# EAGLE design Ctrl_AVR_Reg_Rev30 (EAGLE 5.03)
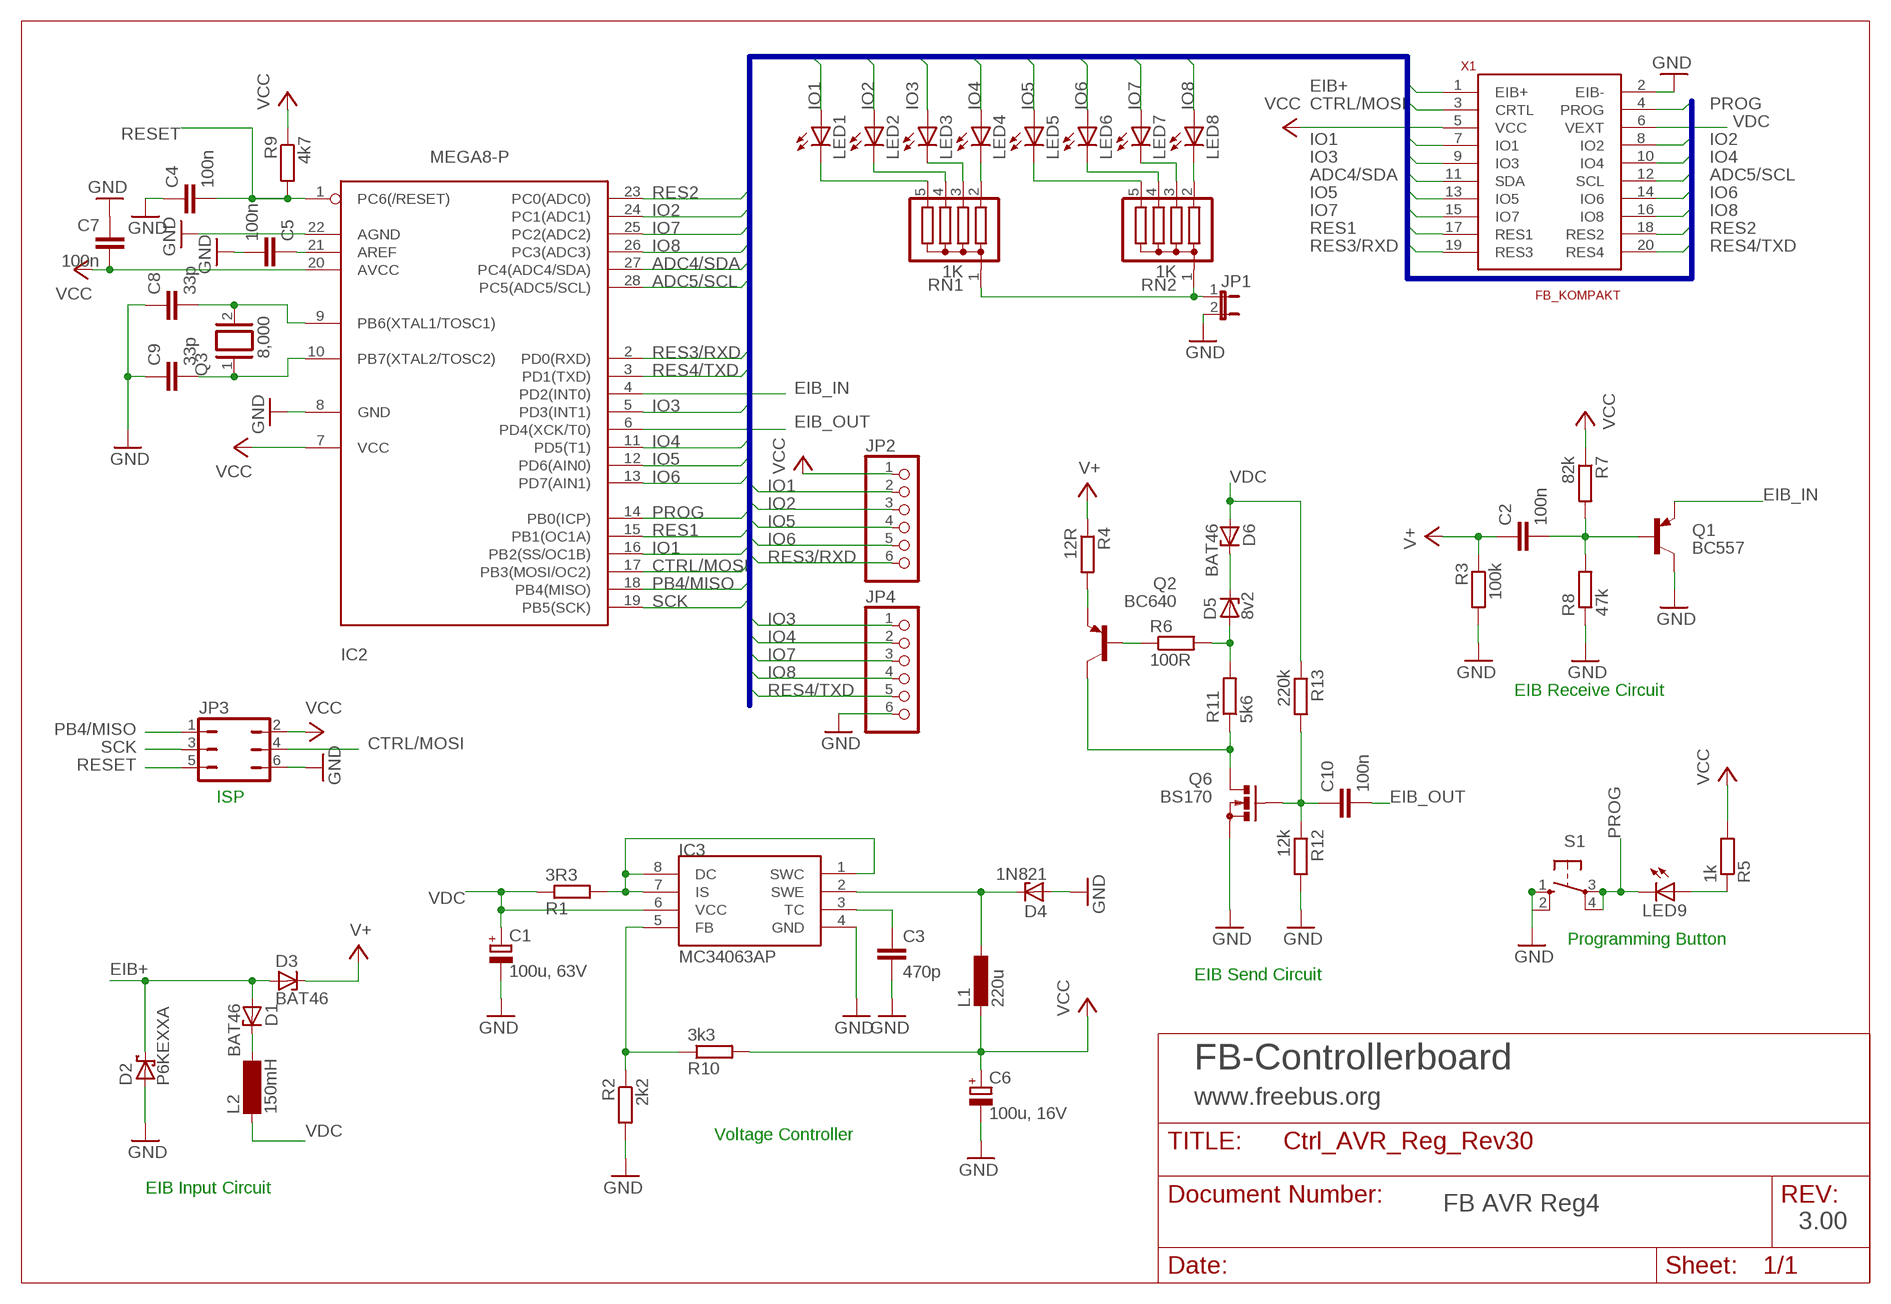
[diagram p0: schematic, sheet 1]

## Parts
C1  100u, 63V  CPOL-EUE5-10.5  [E5-10,5]
C2  100n  C-EU050-025X075  [C050-025X075]
C3  470p  C-EU025-024X044  [C025-024X044]
C4  100n  C-EU050-024X044  [C050-024X044]
C5  100n  C-EU050-025X075  [C050-025X075]
C6  100u, 16V  CPOL-EUE2.5-7  [E2,5-7]
C7  100n  C-EU050-025X075  [C050-025X075]
C8  33p  C-EU025-025X050  [C025-025X050]
C9  33p  C-EU025-025X050  [C025-025X050]
C10  100n  C-EU050-025X075  [C050-025X075]
D1  BAT46  1N821  [DO35Z10]
D2  P6KEXXA  [C1702-15]
D3  BAT46  1N821  [DO35Z10]
D4  1N821  [DO35Z10]
D5  8v2  BZX90  [DO34Z7]
D6  BAT46  1N821  [DO35Z10]
IC2  MEGA8-P  [DIL28-3]
IC3  MC34063AP  [DIL08]
JP1  JP1E  [JP1]
JP2  PINHD-1X6  [1X06]
JP3  JP3Q  [JP3Q]
JP4  PINHD-1X6  [1X06]
L1  220u  L-EU0207/12  [0207/12]
L2  150mH  SD12-1000  [SD12_1000]
LED1  LED3MM  [LED3MM]
LED2  LED3MM  [LED3MM]
LED3  LED3MM  [LED3MM]
LED4  LED3MM  [LED3MM]
LED5  LED3MM  [LED3MM]
LED6  LED3MM  [LED3MM]
LED7  LED3MM  [LED3MM]
LED8  LED3MM  [LED3MM]
LED9  LED3MM  [LED3MM]
Q1  BC557  [TO92]
Q2  BC640  [TO92-BCE]
Q3  8,000  XTAL/S  [QS]
Q6  BS170  [SOT54E]
R1  3R3  R-EU_0207/10  [0207/10]
R2  2k2  R-EU_0207/10  [0207/10]
R3  100k  R-EU_0207/10  [0207/10]
R4  12R  R-EU_0207/10  [0207/10]
R5  1k  R-EU_0207/10  [0207/10]
R6  100R  R-EU_0207/10  [0207/10]
R7  82k  R-EU_0207/10  [0207/10]
R8  47k  R-EU_0207/10  [0207/10]
R9  4k7  R-EU_0207/10  [0207/10]
R10  3k3  R-EU_0207/10  [0207/10]
R11  5k6  R-EU_0207/10  [0207/10]
R12  12k  R-EU_0207/10  [0207/10]
R13  220k  R-EU_0207/10  [0207/10]
RN1  1K  G04R  [SIL5]
RN2  1K  G04R  [SIL5]
S1  10-XX  [B3F-10XX]
X1  FB_KOMPAKT  [ML20]

## Nets
ADC4/SDA: IC2.27(PC4(ADC4/SDA)) X1.11(SDA)
ADC5/SCL: IC2.28(PC5(ADC5/SCL)) X1.12(SCL)
CTRL/MOSI: IC2.17(PB3(MOSI/OC2)) JP3.4 X1.3(CRTL)
EIB+: D1.A D2.C D3.A X1.1(EIB+)
EIB_IN: IC2.4(PD2(INT0)) Q1.1(E)
EIB_OUT: C10.2 IC2.6(PD4(XCK/T0))
GND: C1.- C3.2 C4.1 C5.2 C6.- C7.1 C8.1 C9.1 D2.A D4.A IC2.8(GND) IC2.22(AGND) IC3.4(GND) JP1.2 JP3.6 JP4.6 Q1.3(C) Q6.S R2.2 R3.2 R8.1 R12.2 S1.1(S) S1.2(S1) X1.2(EIB-)
IO1: IC2.16(PB2(SS/OC1B)) JP2.2 LED1.A X1.7(IO1)
IO2: IC2.24(PC1(ADC1)) JP2.3 LED2.A X1.8(IO2)
IO3: IC2.5(PD3(INT1)) JP4.1 LED3.A X1.9(IO3)
IO4: IC2.11(PD5(T1)) JP4.2 LED4.A X1.10(IO4)
IO5: IC2.12(PD6(AIN0)) JP2.4 LED5.A X1.13(IO5)
IO6: IC2.13(PD7(AIN1)) JP2.5 LED6.A X1.14(IO6)
IO7: IC2.25(PC2(ADC2)) JP4.3 LED7.A X1.15(IO7)
IO8: IC2.26(PC3(ADC3)) JP4.4 LED8.A X1.16(IO8)
N$1: Q2.E R4.2
N$2: D5.C D6.C
N$3: C10.1 Q6.G R12.1 R13.2
N$4: Q2.B R6.1
N$5: Q2.C Q6.D R11.1
N$6: D1.C L2.2
N$7 [supply]: C2.2 Q1.2(B) R7.2 R8.2
N$8: C8.2 IC2.9(PB6(XTAL1/TOSC1)) Q3.2
N$9: C9.2 IC2.10(PB7(XTAL2/TOSC2)) Q3.1
N$10: D5.A R6.2 R11.2
N$11: LED4.K(C) RN1.2
N$12: IC3.1(SWC) IC3.7(IS) IC3.8(DC) R1.2
N$13: LED3.K(C) RN1.3
N$14: LED2.K(C) RN1.4
N$15: LED1.K(C) RN1.5
N$16: LED8.K(C) RN2.2
N$17: LED7.K(C) RN2.3
N$18: LED6.K(C) RN2.4
N$19: LED9.A R5.1
N$20: D4.C IC3.2(SWE) L1.1
N$21: C3.1 IC3.3(TC)
N$22: IC3.5(FB) R2.1 R10.1
N$23: LED5.K(C) RN2.5
N$24: C5.1 IC2.21(AREF)
N$25: JP1.1 RN1.1 RN2.1
PB4/MISO: IC2.18(PB4(MISO)) JP3.1
PROG: IC2.14(PB0(ICP)) LED9.K(C) S1.3(P) S1.4(P1) X1.4(PROG)
RES1: IC2.15(PB1(OC1A)) X1.17(RES1)
RES2: IC2.23(PC0(ADC0)) X1.18(RES2)
RES3/RXD: IC2.2(PD0(RXD)) JP2.6 X1.19(RES3)
RES4/TXD: IC2.3(PD1(TXD)) JP4.5 X1.20(RES4)
RESET: C4.2 IC2.1(PC6(/RESET)) JP3.5 R9.2
SCK: IC2.19(PB5(SCK)) JP3.3
V+: C2.1 D3.C R3.1 R4.1
VCC: C6.+ C7.2 IC2.7(VCC) IC2.20(AVCC) JP2.1 JP3.2 L1.2 R5.2 R7.1 R9.1 R10.2 X1.5(VCC)
VDC [supply]: C1.+ D6.A IC3.6(VCC) L2.1 R1.1 R13.1 X1.6(VEXT)

## Buses
IO1,IO2,IO3,IO4,IO5,IO6,IO7,IO8,ADC4/SDA,ADC5/SCL,RES1,RES2,RES3/RXD,RES4/TXD,CTRL/MOSI,PROG,PB4/MISO,EIB+,SCK

## Notes on the sheet
- EIB Receive Circuit
- ISP
- Programming Button
- EIB Send Circuit
- FB-Controllerboard
- www.freebus.org
- Voltage Controller
- EIB Input Circuit
- FB AVR Reg4
- 3.00

## Library data of the parts
C1 C6 = rcl:CPOL-EU: POLARIZED CAPACITOR, European symbol
C2-C5 C7-C10 = rcl:C-EU: CAPACITOR, European symbol
D1 D3 D4 D6 = diode:1N821: Reference DIODE temperature compensated, 6,2 V
D2 = diode:P6KEXXA: DIODE transient-voltage suppressor
D5 = diode:BZX90: Z DIODE
IC2 = atmel:MEGA8-P: MICROCONTROLLER 8 Kbytes FLASH, 1 kbytes SRAM, 512 bytes EEPROM, USART, 4-channel 10 bit ADC, 2-channel 8 bit ADC Pin compatible with Atmega48, ATMega88, ATMega168 Source: avr.lbr
IC3 = mc34063:MC34063
JP1 = jumper:JP1E: JUMPER
JP2 JP4 = pinhead:PINHD-1X6: PIN HEADER
JP3 = jumper:JP3Q: JUMPER
L1 = rcl:L-EU: INDUCTOR, European symbol
L2 = inductor-neosid:SD12: INDUCTOR nominal inductance
LED1-LED9 = led:LED: LED OSRAM: - CHIPLED LG R971, LG N971, LY N971, LG Q971, LY Q971, LO R971, LY R971 LH N974, LH R974 LS Q976, LO Q976, LY Q976 LO Q996 - Hyper CHIPLED LW Q18S LB Q993, LB Q99A, LB R99A - SideLED LS A670, LO A670, LY A670, LG A670, LP A670 LB A673, LV A673, LT A673, LW A673 LH A674 LY A675 LS A676, LA A676, LO A676, LY A676, LW A676 LS A679, LY A679, LG A679 - Hyper Micro SIDELED® LS Y876, LA Y876, LO Y876, LY Y876 LT Y87S - SmartLED LW L88C, LW L88S LB L89C, LB L89S, LG L890 LS L89K, LO L89K, LY L89K LS L896, LA L896, LO L896, LY L896 - TOPLED LS T670, LO T670, LY T670, LG T670, LP T670 LSG T670, LSP T670, LSY T670, LOP T670, LYG T670 LG T671, LOG T671, LSG T671 LB T673, LV T673, LT T673, LW T673 LH T674 LS T676, LA T676, LO T676, LY T676, LB T676, LH T676, LSB T676, LW T676 LB T67C, LV T67C, LT T67C, LS T67K, LO T67K, LY T67K, LW E67C LS E67B, LA E67B, LO E67B, LY E67B, LB E67C, LV E67C, LT E67C LW T67C LS T679, LY T679, LG T679 LS T770, LO T770, LY T770, LG T770, LP T770 LB T773, LV T773, LT T773, LW T773 LH T774 LS E675, LA E675, LY E675, LS T675 LS T776, LA T776, LO T776, LY T776, LB T776 LHGB T686 LT T68C, LB T68C - Hyper Mini TOPLED® LB M676 - Mini TOPLED Santana® LG M470 LS M47K, LO M47K, LY M47K Source: http://www.osram.convergy.de - LUMILED® LXK2-PW12-R00, LXK2-PW12-S00, LXK2-PW14-U00, LXK2-PW14-V00 LXK2-PM12-R00, LXK2-PM12-S00, LXK2-PM14-U00 LXK2-PE12-Q00, LXK2-PE12-R00, LXK2-PE12-S00, LXK2-PE14-T00, LXK2-PE14-U00 LXK2-PB12-K00, LXK2-PB12-L00, LXK2-PB12-M00, LXK2-PB14-N00, LXK2-PB14-P00, LXK2-PB14-Q00 LXK2-PR12-L00, LXK2-PR12-M00, LXK2-PR14-Q00, LXK2-PR14-R00 LXK2-PD12-Q00, LXK2-PD12-R00, LXK2-PD12-S00 LXK2-PH12-R00, LXK2-PH12-S00 LXK2-PL12-P00, LXK2-PL12-Q00, LXK2-PL12-R00 Source: www.luxeon.com
Q1 = transistor-pnp:BC557: PNP Transistor
Q2 = transistor-pnp:BC640*: PNP Transistror
Q3 = special:XTAL/S: CRYSTAL
Q6 = transistor-small-signal:BS170: N-CHANNEL MOS FET
R1-R13 = rcl:R-EU_: RESISTOR, European symbol
RN1 RN2 = resistor-sil:G04R: SIL RESISTOR
S1 = switch-omron:10-XX: OMRON SWITCH
X1 = EIB_Freebus:FB_KOMPAKT: Steckverbinder für Controller <--> Anwendung Kompaktversion Vorteile: - Das Symbol im Schaltplan sieht so aus wie auf dem PCB - Vielleicht schneller zu überblicken, was an welchem Pin angeschlossen ist Nachteile: - Viele unnötige Leitungen im Schaltplan notwendig

## Net classes
0 default: width 0.406 mm
1 supply: width 0.406 mm

## Board
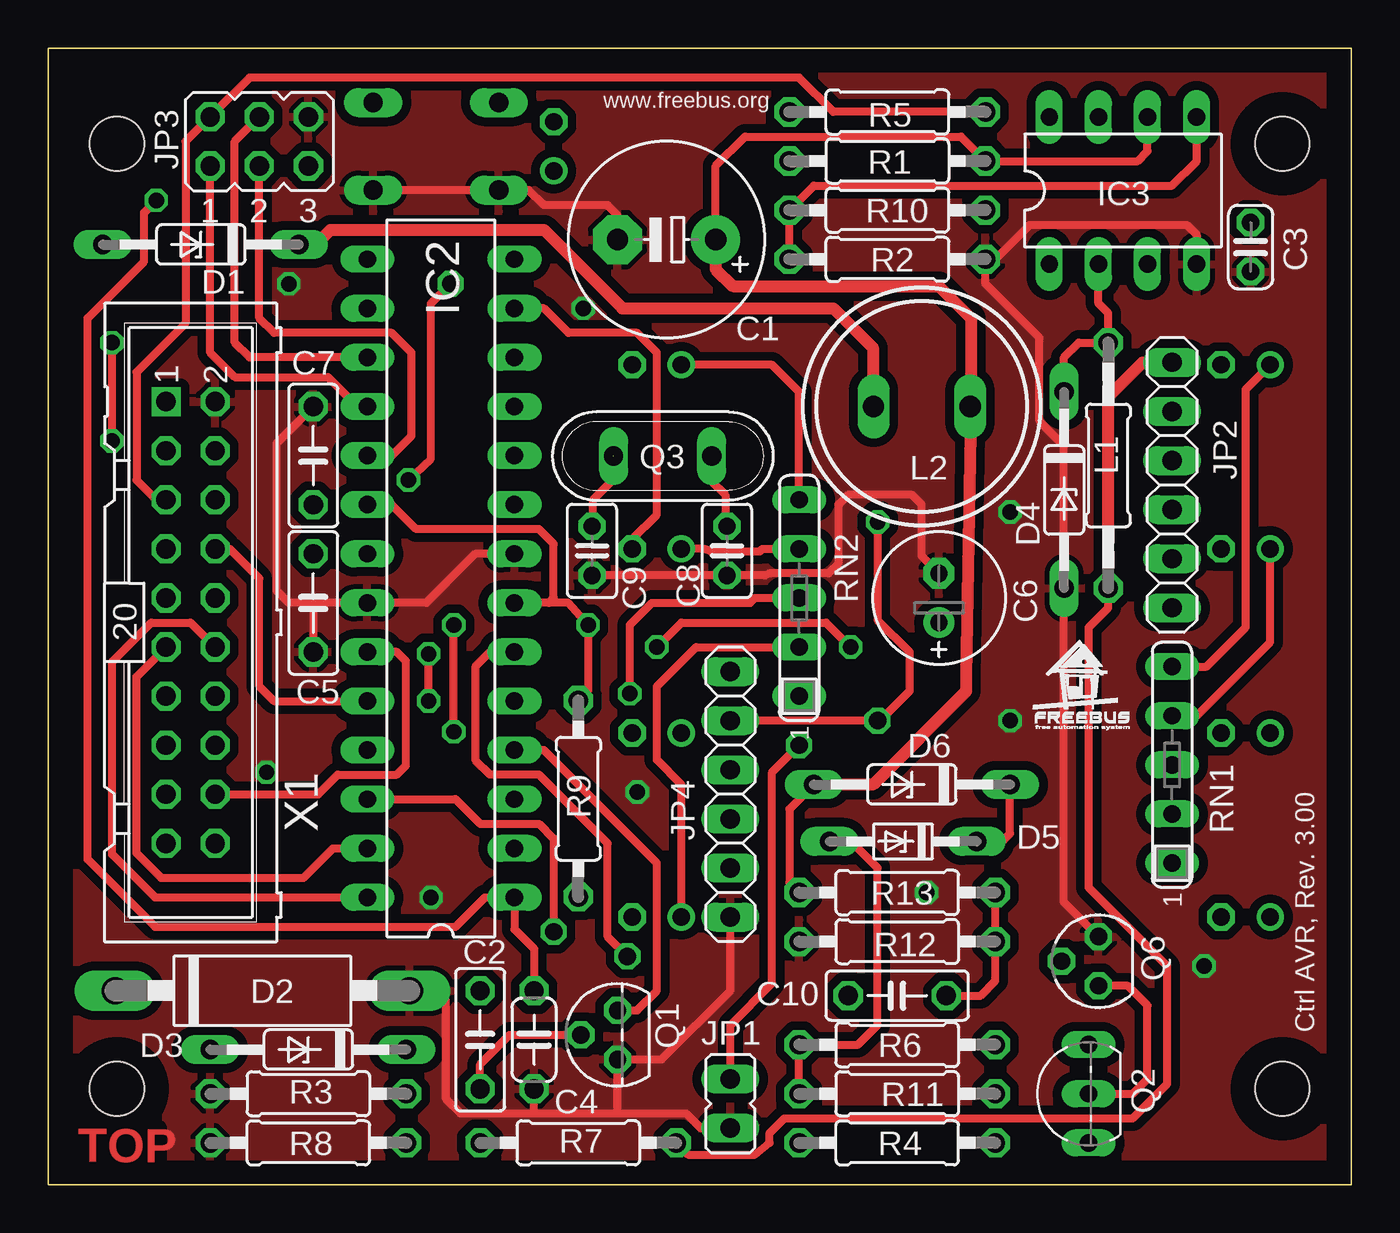
[diagram p1: board, top side]
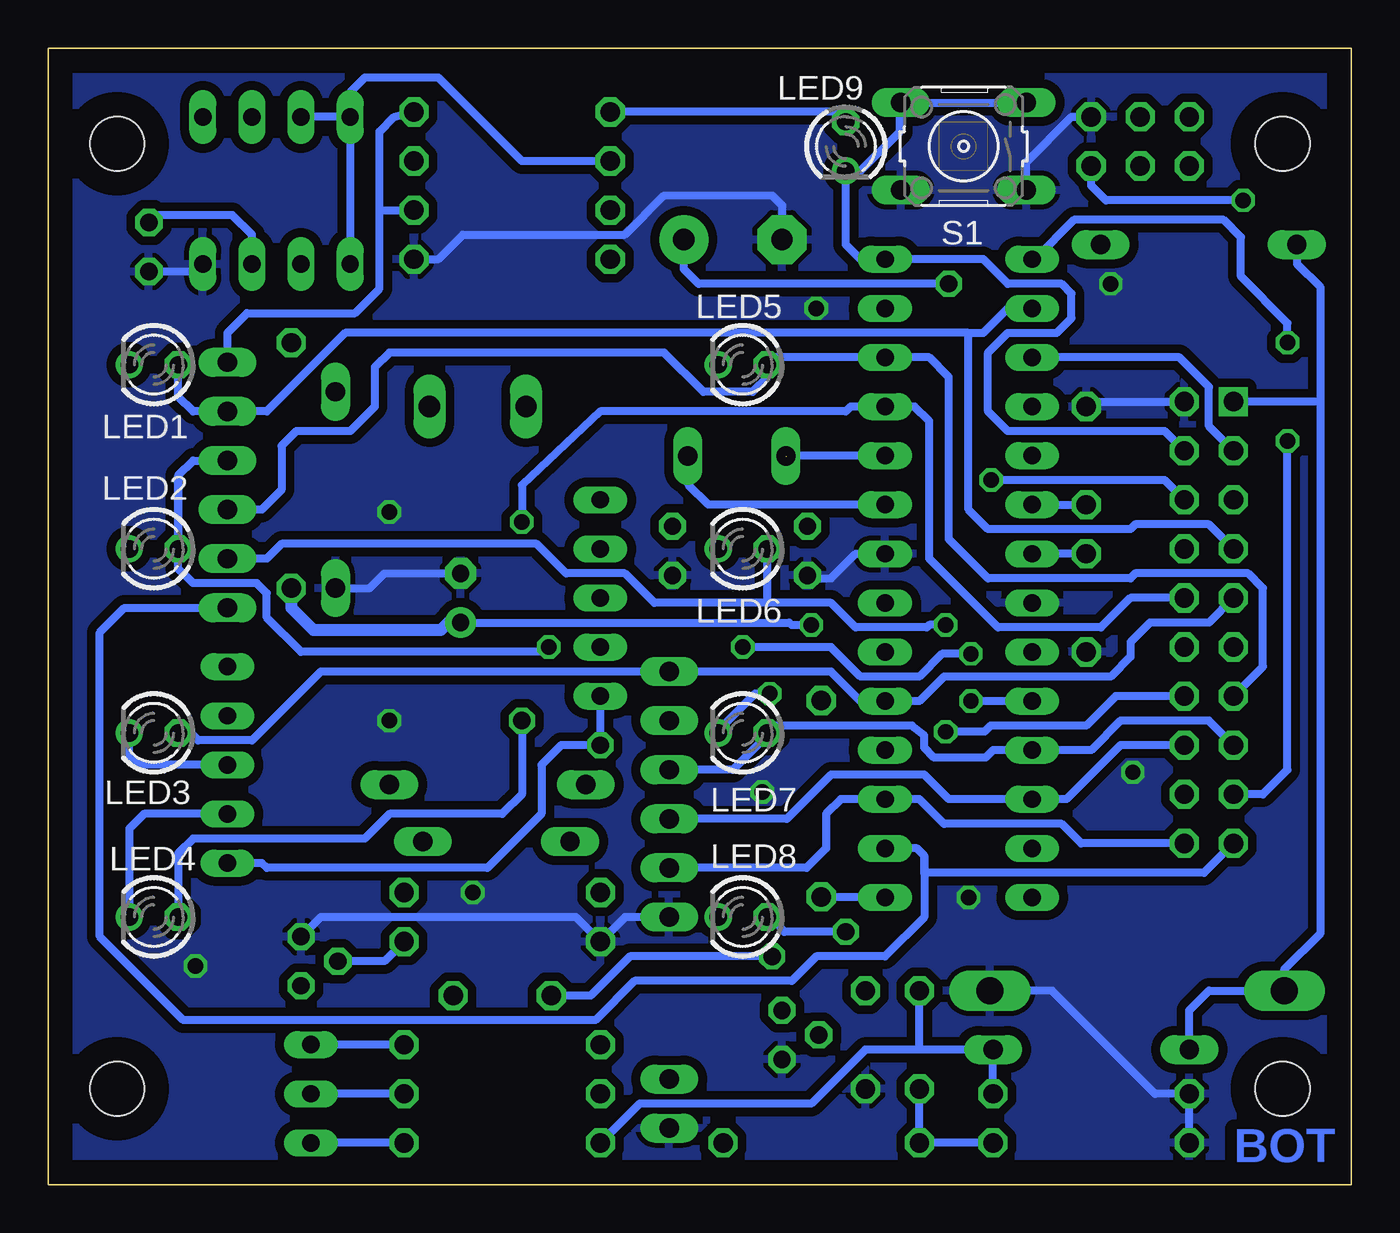
[diagram p2: board, bottom side, seen from below]

Size 67.44 x 58.79 mm. Coordinates in mm from the lower left corner, seen from the top.
Outline: 0,58.79 0,0 67.44,0 67.44,58.79 0,58.79
Copper layers (1*16): Top 0.035mm / dielectric 1.5mm / Bottom 0.035mm
Design rules "idefix-default *": minimum track width 10mil, minimum drill 24mil, track to track 18mil, track to pad 12mil, pad to pad 8mil, via to via 12mil, smd to smd 8mil, copper to edge 50mil, drill to drill 45mil, minimum pad ring 10mil, minimum via ring 8mil, stop-mask expansion 4mil, vias tented up to drill 0mil, thermal gap 10mil
Holes 2.8 mm at 3.55,53.84 63.88,4.95 63.88,53.84 3.55,4.95
Milling: 4 lines

### Footprints (pad centres in the part's own frame; a part is rotated, then mirrored left to right if it is on the bottom)
E5-10,5 = drill 1.1 pad 2.54 round: + -2.54,0 | drill 1.1 pad 2.54 octagon: - 2.54,0
C050-025X075 = drill 1 octagon: 1 -2.54,0; 2 2.54,0
C025-024X044 = drill 0.9 octagon: 1 -1.27,0; 2 1.27,0
C050-024X044 = drill 1 octagon: 1 -2.54,0; 2 2.54,0
E2,5-7 = drill 0.9 pad 1.6 round: + -1.27,0 | drill 0.9 pad 1.6 octagon: - 1.27,0
C025-025X050 = drill 0.9 octagon: 1 -1.27,0; 2 1.27,0
DO35Z10 = drill 1 long: A 5.08,0; C -5.08,0
C1702-15 = drill 1.4 long: A 7.62,0; C -7.62,0
DO34Z7 = drill 1 long: A 3.81,0; C -3.81,0
DIL28-3 = drill 0.9 long: 1 -16.51,-3.81; 2 -13.97,-3.81; 3 -11.43,-3.81; 4 -8.89,-3.81; 5 -6.35,-3.81; 6 -3.81,-3.81; 7 -1.27,-3.81; 8 1.27,-3.81; 9 3.81,-3.81; 10 6.35,-3.81; 11 8.89,-3.81; 12 11.43,-3.81; 13 13.97,-3.81; 14 16.51,-3.81; 15 16.51,3.81; 16 13.97,3.81; 17 11.43,3.81; 18 8.89,3.81; 19 6.35,3.81; 20 3.81,3.81; 21 1.27,3.81; 22 -1.27,3.81; 23 -3.81,3.81; 24 -6.35,3.81; 25 -8.89,3.81; 26 -11.43,3.81; 27 -13.97,3.81; 28 -16.51,3.81
DIL08 = drill 0.9 long: 1 -3.81,-3.81; 2 -1.27,-3.81; 3 1.27,-3.81; 4 3.81,-3.81; 5 3.81,3.81; 6 1.27,3.81; 7 -1.27,3.81; 8 -3.81,3.81
JP1 = drill 1 long: 1 0,-1.27; 2 0,1.27
1X06 = drill 1 long: 1 -6.35,0; 2 -3.81,0; 3 -1.27,0; 4 1.27,0; 5 3.81,0; 6 6.35,0
JP3Q = drill 1 octagon: 1 -2.54,-1.27; 2 -2.54,1.27; 3 0,-1.27; 4 0,1.27; 5 2.54,-1.27; 6 2.54,1.27
0207/12 = drill 1 octagon: 1 -6.35,0; 2 6.35,0
SD12_1000 = drill 1.1 long: 1 -2.5,0; 2 2.5,0
LED3MM = drill 0.9 octagon: A -1.27,0 | drill 0.9 round: K 1.27,0
TO92 = drill 0.9 octagon: 1 1.27,0; 2 0,1.905; 3 -1.27,0
TO92-BCE = drill 0.9 long: B 2.54,0; C 0,0; E -2.54,0
QS = drill 1 long: 1 -2.54,0; 2 2.54,0
SOT54E = drill 0.9 octagon: D -1.27,0; G 0,1.905; S 1.27,0
0207/10 = drill 1 octagon: 1 -5.08,0; 2 5.08,0
SIL5 = drill 0.9 long: 1 -5.08,0; 2 -2.54,0; 3 0,0; 4 2.54,0; 5 5.08,0
B3F-10XX = drill 1 long: 1 -3.251,2.261; 2 3.251,2.261; 3 -3.251,-2.261; 4 3.251,-2.261
ML20 = drill 1 square: 1 -11.43,-1.27 | drill 1 octagon: 2 -11.43,1.27; 3 -8.89,-1.27; 4 -8.89,1.27; 5 -6.35,-1.27; 6 -6.35,1.27; 7 -3.81,-1.27; 8 -3.81,1.27; 9 -1.27,-1.27; 10 -1.27,1.27; 11 1.27,-1.27; 12 1.27,1.27; 13 3.81,-1.27; 14 3.81,1.27; 15 6.35,-1.27; 16 6.35,1.27; 17 8.89,-1.27; 18 8.89,1.27; 19 11.43,-1.27; 20 11.43,1.27

### Placement (x,y rotation side)
C1  32,48.89 180 top
C2  22.35,7.49 270 top
C3  62.23,48.51 270 top
C4  25.14,7.49 90 top
C5  13.71,30.1 270 top
C6  46.1,30.35 90 top
C7  13.71,37.72 270 top
C8  35.13,32.79 90 top
C9  28.14,32.79 90 top
C10  43.94,9.78 180 top
D1  1N821  [DO35Z10]  7.9,48.64 180 top
D2  11.08,10.03 0 top
D3  1N821  [DO35Z10]  13.46,6.98 180 top
D4  52.58,35.94 270 top
D5  BZX90  [DO34Z7]  44.24,17.75 180 top
D6  1N821  [DO35Z10]  44.7,20.7 180 top
IC2  20.32,31.37 90 top
IC3  55.62,51.43 0 top
JP1  35.3,4.19 180 top
JP2  58.16,36.19 270 top
JP3  10.92,53.97 0 top
JP4  35.3,20.19 270 top
L1  54.86,37.21 270 top
L2  45.21,40.26 180 top
LED1  61.97,42.41 180 bottom
LED2  61.97,32.89 180 bottom
LED3  61.97,23.37 180 bottom
LED4  61.97,13.84 180 bottom
LED5  31.49,42.41 180 bottom
LED6  31.49,32.89 180 bottom
LED7  31.49,23.37 180 bottom
LED8  31.49,13.84 180 bottom
LED9  26.16,53.72 270 bottom
Q1  29.46,7.74 90 top
Q2  53.85,4.7 90 top
Q3  31.8,37.69 0 top
Q6  54.35,11.55 90 top
R1  43.43,52.96 180 top
R2  43.43,47.88 0 top
R3  13.46,4.7 180 top
R4  43.94,2.16 0 top
R5  43.43,55.5 0 top
R6  43.94,7.24 180 top
R7  27.43,2.16 180 top
R8  13.46,2.16 0 top
R9  27.43,19.96 270 top
R10  43.43,50.42 0 top
R11  43.94,4.7 180 top
R12  43.94,12.57 180 top
R13  43.94,15.11 0 top
RN1  58.16,21.71 90 top
RN2  38.86,30.35 90 top
S1  20.06,53.72 180 bottom
X1  7.36,29.08 270 top

### Tracks (layer width: path | path; a pad name or v marks a point on that pad's centre or on a via)
ADC4/SDA
  Top 0.406: X1.11 4.57,26.29 4.57,17.14 5.84,15.87 13.21,15.87 14.73,17.4 IC2.27
ADC5/SCL
  Top 0.406: IC2.28 5.52,14.86 3.3,17.08 3.3,27.05 5.33,29.08 7.36,29.08 X1.12
CTRL/MOSI
  Top 0.406: JP3.4 9.65,53.97 9.65,43.56 10.41,42.8 IC2.17
  Bottom 0.406: X1.3 7.36,39.24 7.36,41.27 8.89,42.8 IC2.17
EIB+
  Bottom 0.406: 1.59,40.51 1.59,46.41 2.79,47.62 2.79,48.64 D1.A | 1.59,40.51 X1.1 | 1.59,40.51 1.59,13.01 3.46,11.14 D2.C 7.36,10.03 8.38,9.01 8.38,7.24 8.63,6.98 D3.A
EIB_IN
  Top 0.406: Q1.1 30.48,9.01 31.49,10.03 31.49,16.63 25.65,22.48 IC2.4
EIB_OUT  (via drill 0.9)
  Top 0.406: IC2.6 22.86,27.56 22.13,26.83 22.13,21.94 22.86,21.21 25.4,21.21 28.95,17.65 28.95,12.82 v29.97,11.81
  Bottom 0.406: v29.97,11.81 37.34,11.81 39.37,9.78 C10.2
GND  (via drill 0.8)
  Top 0.406: 13.71,30.1 C5.2 | 13.71,30.1 IC2.22 19.56,30.1 22.1,32.64 IC2.8 | C7.1 11.81,38.35 11.81,30.73 12.44,30.1 13.71,30.1 | JP1.2 33.78,2.92 33.02,3.68 29.46,3.68 | 25.14,3.68 21.33,3.68 20.57,4.44 20.57,9.52 20.06,10.03 D2.A | 25.14,3.68 29.46,3.68 | 29.46,3.68 Q1.3 31.75,6.47 35.3,10.03 JP4.6 | 25.14,3.68 C4.1 | S1.1 16.99,51.46 17.02,51.43 17.04,51.46 S1.2 24.87,51.46 25.65,50.67 28.95,50.67 29.46,50.16 C1.- | IC3.4 59.18,47.62 59.43,47.88 59.43,49.15 58.93,49.65 50.8,49.65 49.02,47.88 R2.2 48.51,46.61 51.31,43.81 51.31,39.49 52.58,38.22 D4.A 52.58,14.6 Q6.S | C6.- 45.21,32.51 45.21,35.18 44.7,35.68 41.4,35.68 40.89,35.18 40.89,32.13 40.38,31.62 37.34,31.62 37.11,31.52 C8.1 C9.1
  Bottom 0.406: R2.2 47.24,47.88 45.97,49.15 37.59,49.15 35.56,51.18 29.97,51.18 29.46,50.67 C1.- | IC2.8 25.65,32.64 26.92,31.37 27.68,31.37 27.71,31.39 C9.1 | C7.1 13.46,40.51 X1.2 | R8.1 R3.2 10.16,4.7 15.49,10.03 D2.A | JP4.6 37.59,13.84 R12.2 40.13,13.84 53.34,13.84 Q6.S | S1.1 16.81,52.9 14.48,55.24 JP3.6 | C6.- 50.04,31.62 50.8,30.86 D4.A | IC3.4 59.82,47.24 C3.2
  other vias: 27.68,45.34 11.3,21.33 59.82,11.3 45.46,15.11 30.48,20.32 49.78,24 49.78,34.79 12.44,46.61 19.81,14.86
  pour Top: 0.25,58.29 0.25,0.12 57.49,0.09 57.42,0.13 67.18,0.06 67.31,24.38 67.31,58.29
  pour Bottom: 0.3,58.29 67.21,58.29 67.21,0.43 16.95,0.23 9.81,0.17 0.3,0.17
IO1
  Bottom 0.406: IC2.16 17.78,45.34 19.05,44.07 19.81,44.07 | 19.81,44.07 52.07,44.07 56.13,40 JP2.2 59.94,40 60.7,40.76 LED1.A | X1.7 7.36,34.16 11.17,34.16 11.43,33.91 18.79,33.91 19.81,34.92 19.81,44.07
IO2  (via drill 0.8)
  Top 0.406: IC2.24 11.68,25.02 10.92,25.78 10.92,31.37 9.4,32.89 X1.8 | v19.68,25.02 v19.68,27.46 | v31.49,27.81 32.76,29.08 40.26,29.08 v41.53,27.81
  Bottom 0.406: LED2.A 60.45,32.89 60.7,33.14 60.7,36.7 | JP2.3 59.94,37.46 60.7,36.7 | 60.7,36.7 60.7,31.87 59.94,31.11 56.64,31.11 56.13,30.6 56.13,29.33 54.35,27.56 41.78,27.56 v41.53,27.81 | IC2.24 v19.68,25.02 | v19.68,27.46 21.18,27.46 22.35,26.29 25.4,26.29 26.92,27.81 v31.49,27.81
IO3
  Bottom 0.406: X1.9 7.36,29.08 10.41,29.08 11.43,28.06 11.43,27.3 12.44,26.29 21.08,26.29 22.35,25.02 IC2.5 25.4,25.02 26.92,26.54 JP4.1 53.34,26.54 56.89,22.98 59.69,22.98 60.07,23.37 LED3.A
IO4  (via drill 0.8, 0.9)
  Top 0.406: JP4.2 v42.92,24 43.05,24 44.58,25.52 44.58,27.56 42.92,29.21 v42.92,34.29
  Bottom 0.406: v42.92,34.29 42.92,36.19 38.86,40 26.16,40 25.91,40.26 IC2.11 22.6,40.26 21.84,39.49 21.84,32.38 18.29,28.83 12.95,28.83 11.43,30.35 X1.10 | LED4.A 60.7,17.14 59.94,17.9 51.05,17.9 49.78,19.17 43.94,19.17 42.92,20.19 v42.92,24
IO5
  Bottom 0.406: JP2.4 56.39,34.92 55.37,35.94 55.37,38.22 54.61,38.99 51.81,38.99 50.54,40.26 50.54,42.29 49.78,43.05 35.56,43.05 33.53,41.02 30.99,41.02 30.22,41.78 LED5.A 30.22,42.54 29.97,42.8 IC2.12 21.84,42.8 20.83,41.78 20.83,33.4 18.79,31.37 11.43,31.37 11.17,31.62 5.33,31.62 4.57,30.86 4.57,26.79 X1.13
IO6  (via drill 0.8)
  Top 0.406: LED6.A 30.22,33.4 31.49,34.67 31.49,43.05 30.48,44.07 26.92,44.07 25.65,45.34 IC2.13 | v20.99,23.43 v20.99,28.95
  Bottom 0.406: 30.22,30.1 36.07,30.1 37.59,31.62 40.64,31.62 42.16,33.14 55.37,33.14 56.13,32.38 JP2.5 | 30.22,30.1 LED6.A | X1.14 12.19,25.27 13.71,23.75 18.67,23.75 18.99,23.43 v20.99,23.43 | 20.95,28.95 v20.99,28.95 21.84,28.95 21.97,28.83 25.65,28.83 26.92,30.1 30.22,30.1
IO7
  Bottom 0.406: X1.15 7.36,24 11.94,24 13.46,22.48 IC2.25 18.54,22.48 18.92,22.1 21.59,22.1 22.1,22.6 22.1,23.24 22.73,23.75 29.72,23.75 30.22,23.24 | 30.22,23.24 LED7.A | 30.22,23.24 32,21.46 JP4.3
IO8  (via drill 0.9)
  Top 0.406: IC2.26 21.08,19.94 22.35,18.67 25.4,18.67 26.16,17.9 v26.16,13.08
  Bottom 0.406: X1.16 11.94,22.73 14.73,19.94 IC2.26 20.83,19.94 22.1,21.21 26.92,21.21 29.21,18.92 JP4.4 | LED8.A 29.97,13.84 29.34,13.08 v26.16,13.08
N$1
  Bottom 0.406: R4.2 Q2.E
N$2
  Top 0.406: D5.C 49.38,17.75 49.78,18.16 D6.C
N$3
  Top 0.406: R13.2 R12.1 49.02,10.54 48.26,9.78 C10.1
  Bottom 0.406: R12.1 50.04,11.55 Q6.G
N$4
  Bottom 0.406: R6.1 Q2.B
N$5
  Top 0.406: Q6.D 55.88,10.28 56.89,9.27 56.89,5.46 56.13,4.7 Q2.C
  Bottom 0.406: R11.1 Q2.C 54.1,4.95
N$6
  Top 0.61: D1.C 13.84,48.64 14.6,49.4 25.65,49.4 29.72,45.34 40.64,45.34 42.67,43.3 42.67,40.26 L2.2
N$7
  Top 0.406: C2.2 22.35,6.22 23.87,7.74 Q1.2
  Bottom 0.406: R8.2 R7.2 C2.2
N$8
  Top 0.406: Q3.2 34.34,36.39 35.05,35.68 35.05,33.91 35.08,33.93 C8.2
  Bottom 0.406: IC2.9 33.27,35.18 34.29,36.19 34.29,37.46 34.34,37.51 Q3.2
N$9  (1 unrouted)
  Top 0.406: 29.23,37.69 29.23,36.47 28.19,35.43 28.19,33.91 28.17,33.93 C9.2
  Bottom 0.406: 29.23,37.82 29.21,37.72 28.95,37.72 | IC2.10 28.95,37.72 | 29.23,37.82 29.21,37.69 28.95,37.72 | 29.23,37.82 29.23,37.72 29.26,37.72 Q3.1
N$10
  Top 0.406: R11.2 R6.2 41.91,7.24 42.92,8.25 42.92,16.38 41.55,17.75 D5.A
N$11
  Bottom 0.406: RN1.2 62.48,19.17 63.24,18.41 LED4.K
N$12
  Bottom 0.406: IC3.8 IC3.7 | IC3.8 IC3.1 | R1.2 42.92,52.96 47.24,57.27 51.05,57.27 51.81,56.51 51.81,55.75 52.07,55.5 IC3.8
N$13
  Bottom 0.406: RN1.3 62.74,21.71 63.24,22.22 LED3.K
N$14
  Top 0.406: LED2.K 63.24,28.06 59.43,24.25 RN1.4
N$15
  Top 0.406: LED1.K 61.97,41.14 61.97,28.83 59.94,26.79 RN1.5
N$16
  Top 0.406: LED8.K 32.76,20.7 31.49,21.97 31.49,25.78 33.53,27.81 RN2.2
N$17  (via drill 0.8)
  Top 0.406: RN2.3 36.57,30.35 36.32,30.1 31.24,30.1 30.1,28.95 v30.1,25.4
  Bottom 0.406: LED7.K 32.76,23.49 30.86,25.4 v30.1,25.4
N$18
  Top 0.406: RN2.4 36.96,32.89 36.83,32.76 34.29,32.76 33.91,32.89 LED6.K
N$19
  Bottom 0.406: R5.1 26.67,55.5 LED9.A
N$20
  Top 0.406: D4.C 52.58,42.8 53.34,43.56 L1.1 54.86,45.08 54.35,45.59 IC3.2
N$21
  Bottom 0.406: IC3.3 56.89,49.15 57.91,50.16 61.85,50.16 C3.1
N$22
  Top 0.406: R2.1 R10.1 39.62,51.69 58.16,51.69 59.43,52.96 IC3.5
N$23
  Top 0.406: LED5.K 37.46,42.41 38.86,41.02 RN2.5
N$24
  Bottom 0.406: 13.46,32.64 C5.1 IC2.21
N$25  (via drill 0.9)
  Top 0.406: JP1.1 35.3,8.25 37.46,10.41 37.46,21.33 v38.86,22.73
  Bottom 0.406: v38.86,22.73 RN2.1 | v38.86,22.73 38.61,22.73 | v38.86,22.73 40.89,22.73 41.91,21.71 41.91,19.17 44.7,16.38 56.13,16.38 56.39,16.63 RN1.1
PB4/MISO
  Top 0.406: IC2.18 16,40.26 14.48,41.78 9.65,41.78 8.38,43.05 JP3.1
PROG
  Bottom 0.406: S1.4 S1.3 | S1.4 23.34,55.98 23.37,56 | S1.4 23.32,55.8 23.37,55.75 23.37,54.48 25.4,52.45 LED9.K 26.16,48.64 25.4,47.88 IC2.14 19.05,47.88 17.78,46.61 14.98,46.61 14.48,46.1 14.48,44.83 15.24,44.07 17.78,44.07 18.79,43.05 18.79,40 17.78,38.99 9.65,38.99 X1.4
RES1  (via drill 0.8)
  Top 0.406: v3.3,38.48 v3.3,43.56
  Bottom 0.406: IC2.15 16.38,47.88 14.35,49.91 6.6,49.91 5.71,49.02 5.71,46.99 3.3,44.57 v3.3,43.56 | X1.17 4.57,20.19 3.3,21.46 v3.3,38.48
RES2
  Top 0.406: X1.18 13.97,20.19 14.98,21.21 18.03,21.21 18.51,21.68 18.51,27.08 18.03,27.56 IC2.23
RES3/RXD
  Bottom 0.406: X1.19 7.62,16.13 22.1,16.13 22.1,17.02 | 22.1,17.02 22.48,17.4 IC2.2 | 22.1,17.02 22.1,13.84 24.13,11.81 27.68,11.81 28.95,10.54 37.08,10.54 39.11,8.51 60.45,8.51 64.77,12.82 64.77,28.57 63.5,29.84 JP2.6
RES4/TXD
  Bottom 0.406: X1.20 13.97,17.65 14.98,18.67 21.08,18.67 22.35,19.94 IC2.3 26.41,19.94 27.18,19.17 27.18,17.4 28.19,16.38 JP4.5
RESET  (via drill 0.8)
  Top 0.406: C4.2 25.14,12.19 24.13,13.21 IC2.1 22.6,14.86 21.08,13.33 5.52,13.33 2.03,16.82 2.03,44.83 4.95,47.75 4.95,50.29 v5.59,50.92
  Bottom 0.406: R9.2 27.43,14.86 IC2.1 | v5.59,50.92 12.7,50.92 13.46,51.69 JP3.5
SCK
  Top 0.406: JP3.3 10.92,44.83 11.68,44.07 17.78,44.07 18.79,43.05 18.79,38.73 17.78,37.72 IC2.19
V+
  Bottom 0.406: R3.1 D3.C 22.35,6.98 | R4.1 36.83,4.19 27.94,4.19 25.14,6.98 22.35,6.98 | 22.35,6.98 C2.1
VCC  (via drill 0.8)
  Top 0.406: 25.91,30.1 IC2.7 | 27.43,25.02 R9.1 27.94,25.55 v27.94,28.95 26.92,30.1 25.91,30.1 | IC2.20 17.78,35.18 19.05,33.91 25.4,33.91 26.16,33.14 26.16,30.35 25.91,30.1 | R7.1 33.11,1.55 36.57,1.55 37.34,2.16 37.34,2.66 38.1,3.43 56.13,3.43 57.91,5.2 57.91,11.3 53.85,15.36 53.85,28.83 54.86,29.84 L1.2 | X1.5 5.59,35.43 4.57,36.45 4.57,42.03 7.11,44.57 7.11,53.97 JP3.2 10.41,57.27 38.86,57.27 40.64,55.5 R5.2 48.77,55.5
  Top 0.61: JP2.1 56.64,42.54 54.86,40.76 L1.2
  Bottom 0.406: JP2.1 58.16,44.07 57.15,45.08 51.56,45.08 50.29,46.35 50.29,50.42 | R10.2 48.51,50.67 48.77,50.42 50.29,50.42 | IC2.20 C7.2 | 50.29,50.42 50.29,54.48 49.53,55.24 R5.2 | C6.+ 29.08,29.08 28.95,28.95 v27.94,28.95
  Bottom 0.61: L1.2 54.86,29.84 53.72,28.7 47.12,28.7 46.73,29.08 C6.+
VDC  (via drill 0.8, 0.9)
  Top 0.406: C1.+ 34.54,52.7 36.07,54.23 47.24,54.23 R1.1 56.39,52.96 56.89,53.46 IC3.6 | R13.1 38.35,15.62 38.35,19.43 D6.A | v18.64,36.45 19.81,37.56 19.81,45.59 v20.83,46.61
  Top 0.61: 47.75,40.26 47.75,44.83 46.1,46.48 35.43,46.48 34.54,47.37 C1.+ | D6.A 42.67,20.7 47.5,25.52 47.5,26.29 47.75,40.26 | 47.75,40.26 L2.1
  Bottom 0.406: X1.6 9.65,36.45 v18.64,36.45 | v20.83,46.61 33.78,46.61 34.54,47.37 C1.+

### Text on the board
Top: TOP
Bottom: BOT
tNames: www.freebus.org | Ctrl AVR, Rev. 3.00
Case: Freebus | Binäreingang, 8x230 V
Drill_legend: Bohrlegende | Datum: 28.12.2008 16:30:27 | 2.8000 mm / 110.236 mil | 1.4000 mm / 55.118 mil | 1.1000 mm / 43.307 mil | 1.0000 mm / 39.370 mil | 0.9000 mm / 35.433 mil | 0.8000 mm / 31.496 mil